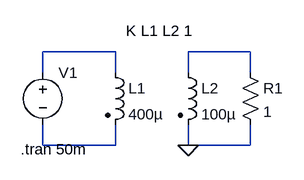
[diagram p0: schematic transformadores.asc]
transformadores.asc, the LTspice schematic file:
Version 4
SHEET 1 880 680
WIRE -528 368 -640 368
WIRE -320 368 -416 368
WIRE -640 400 -640 368
WIRE -528 400 -528 368
WIRE -416 400 -416 368
WIRE -320 400 -320 368
WIRE -640 512 -640 480
WIRE -528 512 -528 480
WIRE -528 512 -640 512
WIRE -416 512 -416 480
WIRE -320 512 -320 480
WIRE -320 512 -416 512
FLAG -416 512 0
SYMBOL ind2 -544 384 R0
SYMATTR InstName L1
SYMATTR Value 400µ
SYMATTR Type ind
SYMATTR SpiceLine Rser=1m
SYMBOL ind2 -432 384 R0
SYMATTR InstName L2
SYMATTR Value 100µ
SYMATTR Type ind
SYMBOL voltage -640 384 R0
WINDOW 3 24 96 Invisible 2
WINDOW 123 0 0 Left 0
WINDOW 39 0 0 Left 0
SYMATTR InstName V1
SYMATTR Value SINE(0 179.6 60)
SYMBOL res -336 384 R0
SYMATTR InstName R1
SYMATTR Value 1
TEXT -512 336 Left 2 !K L1 L2 1
TEXT -674 518 Left 2 !.tran 50m

The netlist it stands for:
* transformadores.asc
L1 N001 N003 400µ Rser=1m
L2 N002 0 100µ
V1 N001 N003 SINE(0 179.6 60)
R1 N002 0 1
K L1 L2 1
.tran 50m
.backanno
.end